# Altium schematic sheet MASTER.SchDoc
size A; SheetNumber: 5; SheetTotal: 9
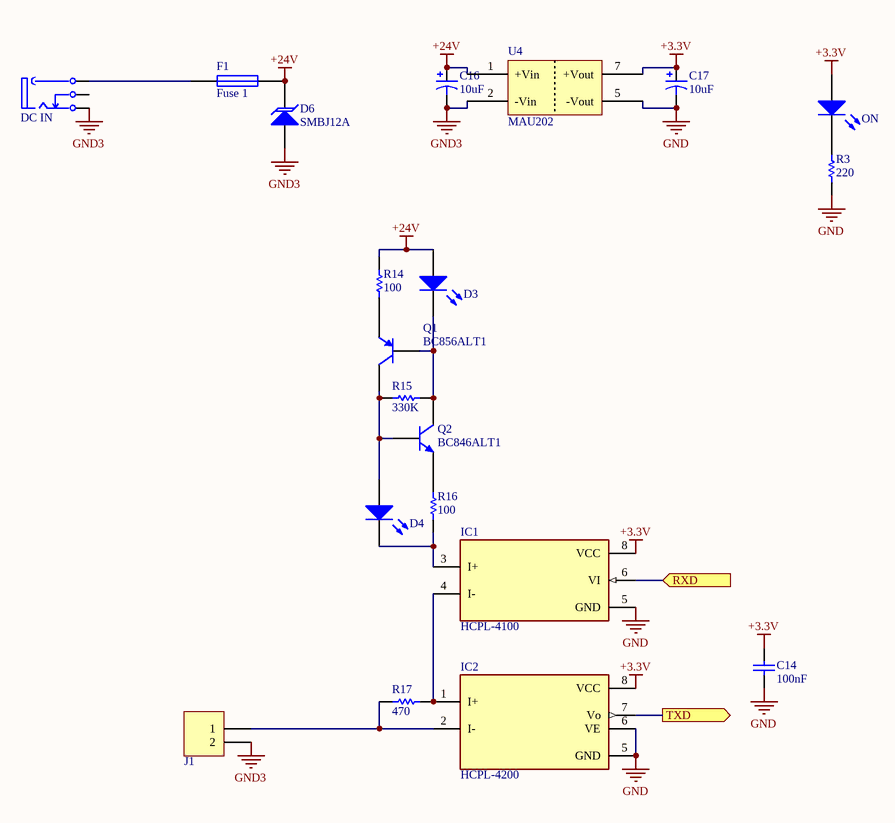
[diagram p0: MASTER.SchDoc]

## Parts
C14  100nF  [C603]
C16  10uF  [CAP-TAN-B]
C17  10uF  [CAP-TAN-B]
D3  LED  [LED-1206]  (value not drawn)
D4  LED  [LED-1206]  (value not drawn)
D6  SMBJ12A  [DO-214AA]
DC_IN  JACK  [jack-dc]  (value not drawn)
F1  Fuse 1  [PTC-0805]
IC1  HCPL-4100  [DIP-8]
IC2  HCPL-4200  [DIP-8]
J1  CONN-2  [XH-2]  (value not drawn)
ON  LED  [LED-1206]  (value not drawn)
Q1  BC856ALT1  [SOT-23]
Q2  BC846ALT1  [SOT-23]
R3  220  [R805]
R14  100  [R805]
R15  330K  [R805]
R16  100  [R805]
R17  470  [R805]
U4  MAU202  [MAU202]

## Ports
RXD (in), TXD (out)

## Nets
+3.3V: C14.2 C17.1 IC1.8(VCC) IC2.8(VCC) ON.1(A) U4.7(+Vout)
+24V: C16.1 D3.1(A) D6.2(K) F1.2 R14.2 U4.1(+Vin)
GND: C14.1 C17.2 IC1.5(GND) IC2.5(GND) IC2.6(VE) R3.1 U4.5(-Vout)
GND3: C16.2 D6.1(A) DC_IN.3(sleeve) J1.2 U4.2(-Vin)
RXD: IC1.6(VI) ; port RXD
TXD: IC2.7(Vo) ; port TXD
NetD3_2: D3.2(K) Q1.1(B) Q2.3(C) R15.1
NetD4_1: D4.1(A) Q1.3(C) Q2.1(B) R15.2
NetD4_2: D4.2(K) IC1.3(I+) R16.1
NetDC_IN_2: DC_IN.2(tip) F1.1
NetIC1_4: IC1.4(I-) IC2.1(I+) R17.2
NetIC2_2: IC2.2(I-) J1.1 R17.1
NetON_2: ON.2(K) R3.2
NetQ1_2: Q1.2(E) R14.1
NetQ2_2: Q2.2(E) R16.2

Not connected (* = marked no-connect by the designer): DC_IN 1(det)

## Library data of the parts
C14 = Cap: Capacitor; Designer: Parsa Malekpour; Value: 100nF
C16 C17 = CAP-POL: Polar Capacitor; Voltage: 10V; Value: 10uF
D6 = SMBJxxA: Surface Mount Transient Voltage Suppressors Diode; Parameter 1: *
DC_IN = JACK-DC
F1 = Fuse 1: Fuse; Published: 8-Jun-2000; LatestRevisionDate: 17-Jul-2002; LatestRevisionNote: Re-released for DXP Platform.; PackageReference: PIN-W2/E2.8; Publisher: Altium Limited; PackageDescription: Thru-Hole; 2 Leads
IC1 = HCPL-4100: <b>Isolation Amplifer</b><p> Source: http://www.avagotech.com/docs/AV02-0410EN; MF: {'manufacturer': u'Broadcom Limited'}; Package: None; Value: *; Price: None; MP: HCPL-4100; Availability: Unavailable
IC2 = HCPL-4200: Optically Coupled 20 mA Current Loop Receiver; MF: {'manufacturer': u'Broadcom Limited'}; Package: None; Value: *; Price: None; MP: HCPL-4100; Availability: Unavailable
Q1 = BC856ALT1: General Purpose Transistor PNP Silicon; Published: 29-Sep-2000; LatestRevisionDate: 17-Jul-2002; LatestRevisionNote: Re-released for DXP Platform.; DatasheetVersion: 1997; PackageVersion: 1997; PackageReference: 318-08; Publisher: Altium Limited; PackageDescription: SOT-23; 3 Leads; Body 3.0 x 2.6 mm, inc. leads (LxW max); ComponentLink1Description: Manufacturer Link; ComponentLink1URL: http://www.onsemi.com/site/products/landing?taxonomyID=194; ComponentLink2Description: Datasheet; ComponentLink2URL: http://www.onsemi.com/pub/Collateral/BC856ALT1-D.PDF
Q2 = BC846ALT1: General Purpose Transistor NPN Silicon; Published: 29-Sep-2000; LatestRevisionDate: 17-Jul-2002; LatestRevisionNote: Re-released for DXP Platform.; DatasheetVersion: 1997; PackageVersion: 1997; PackageReference: 318-08; Publisher: Altium Limited; PackageDescription: SOT-23; 3 Leads; Body 3.0 x 2.6 mm, inc. leads (LxW max); ComponentLink1Description: Manufacturer Link; ComponentLink1URL: http://www.onsemi.com/site/products/landing?taxonomyID=194; ComponentLink2Description: Datasheet; ComponentLink2URL: http://www.onsemi.com/pub/Collateral/BC846ALT1-D.PDF
R3 R14-R17 = Resistor: Designer: Parsa Malekpour
  R3: Value: 220
  R14 R16: Value: 100
  R15: Value: 330K
  R17: Value: 470
U4 = MAU202: 1W, FIXED INPUT ISOLATED & UNREGULATED / SINGLE OUTPUT DC-DC CONVERTER